# Altium schematic sheet LM3150MHX1_LM3150MHX.schdoc
size 127 x 101 mm
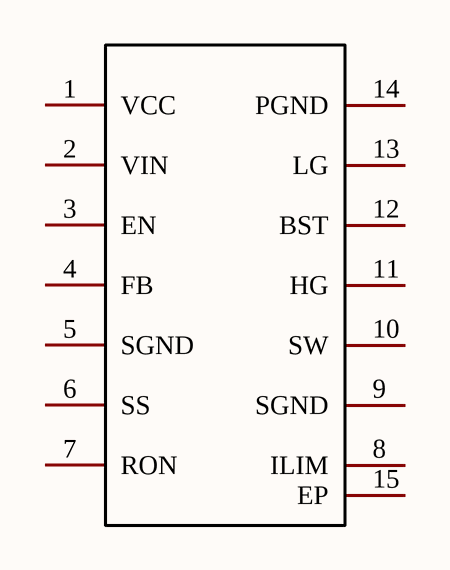
[diagram p0: LM3150MHX1_LM3150MHX.schdoc]

## Parts
U?  LM3150MHX/NOPB  [HTSSOP-14_L5.0-W4.4-P0.65-LS6.4-BL-EP]  (value not drawn)

## Nets

Not connected (* = marked no-connect by the designer): U? 1(VCC) 2(VIN) 3(EN) 4(FB) 5(SGND) 6(SS) 7(RON) 8(ILIM) 9(SGND) 10(SW) 11(HG) 12(BST) 13(LG) 14(PGND) 15(EP)

## Library data of the parts
U? = LM3150MHX/NOPB: Manufacturer: TI(德州仪器); Add into BOM: yes; Function: 降压型; Input Voltage: 6V~42V; Output Current (Max): 12A; Switching Frequency: 1MHz; Synchronous Rectification: 是; Number of Outputs: 1; Topology: 降压式; Symbol: LM3150MHX; Device: LM3150MHX/NOPB; LCSC Part Name: LM3150MHX/NOPB; Supplier Part: C48112; Manufacturer Part: LM3150MHX/NOPB; Supplier Footprint: HTSSOP-14-EP; JLCPCB Part Class: Extended Part; Datasheet: https://www.ti.com/cn/lit/gpn/lm3150; Supplier: LCSC; Convert to PCB: yes; Operating Temperature: -40℃~+125℃@(TJ)